# Altium project STM32四轴.PrjPCB
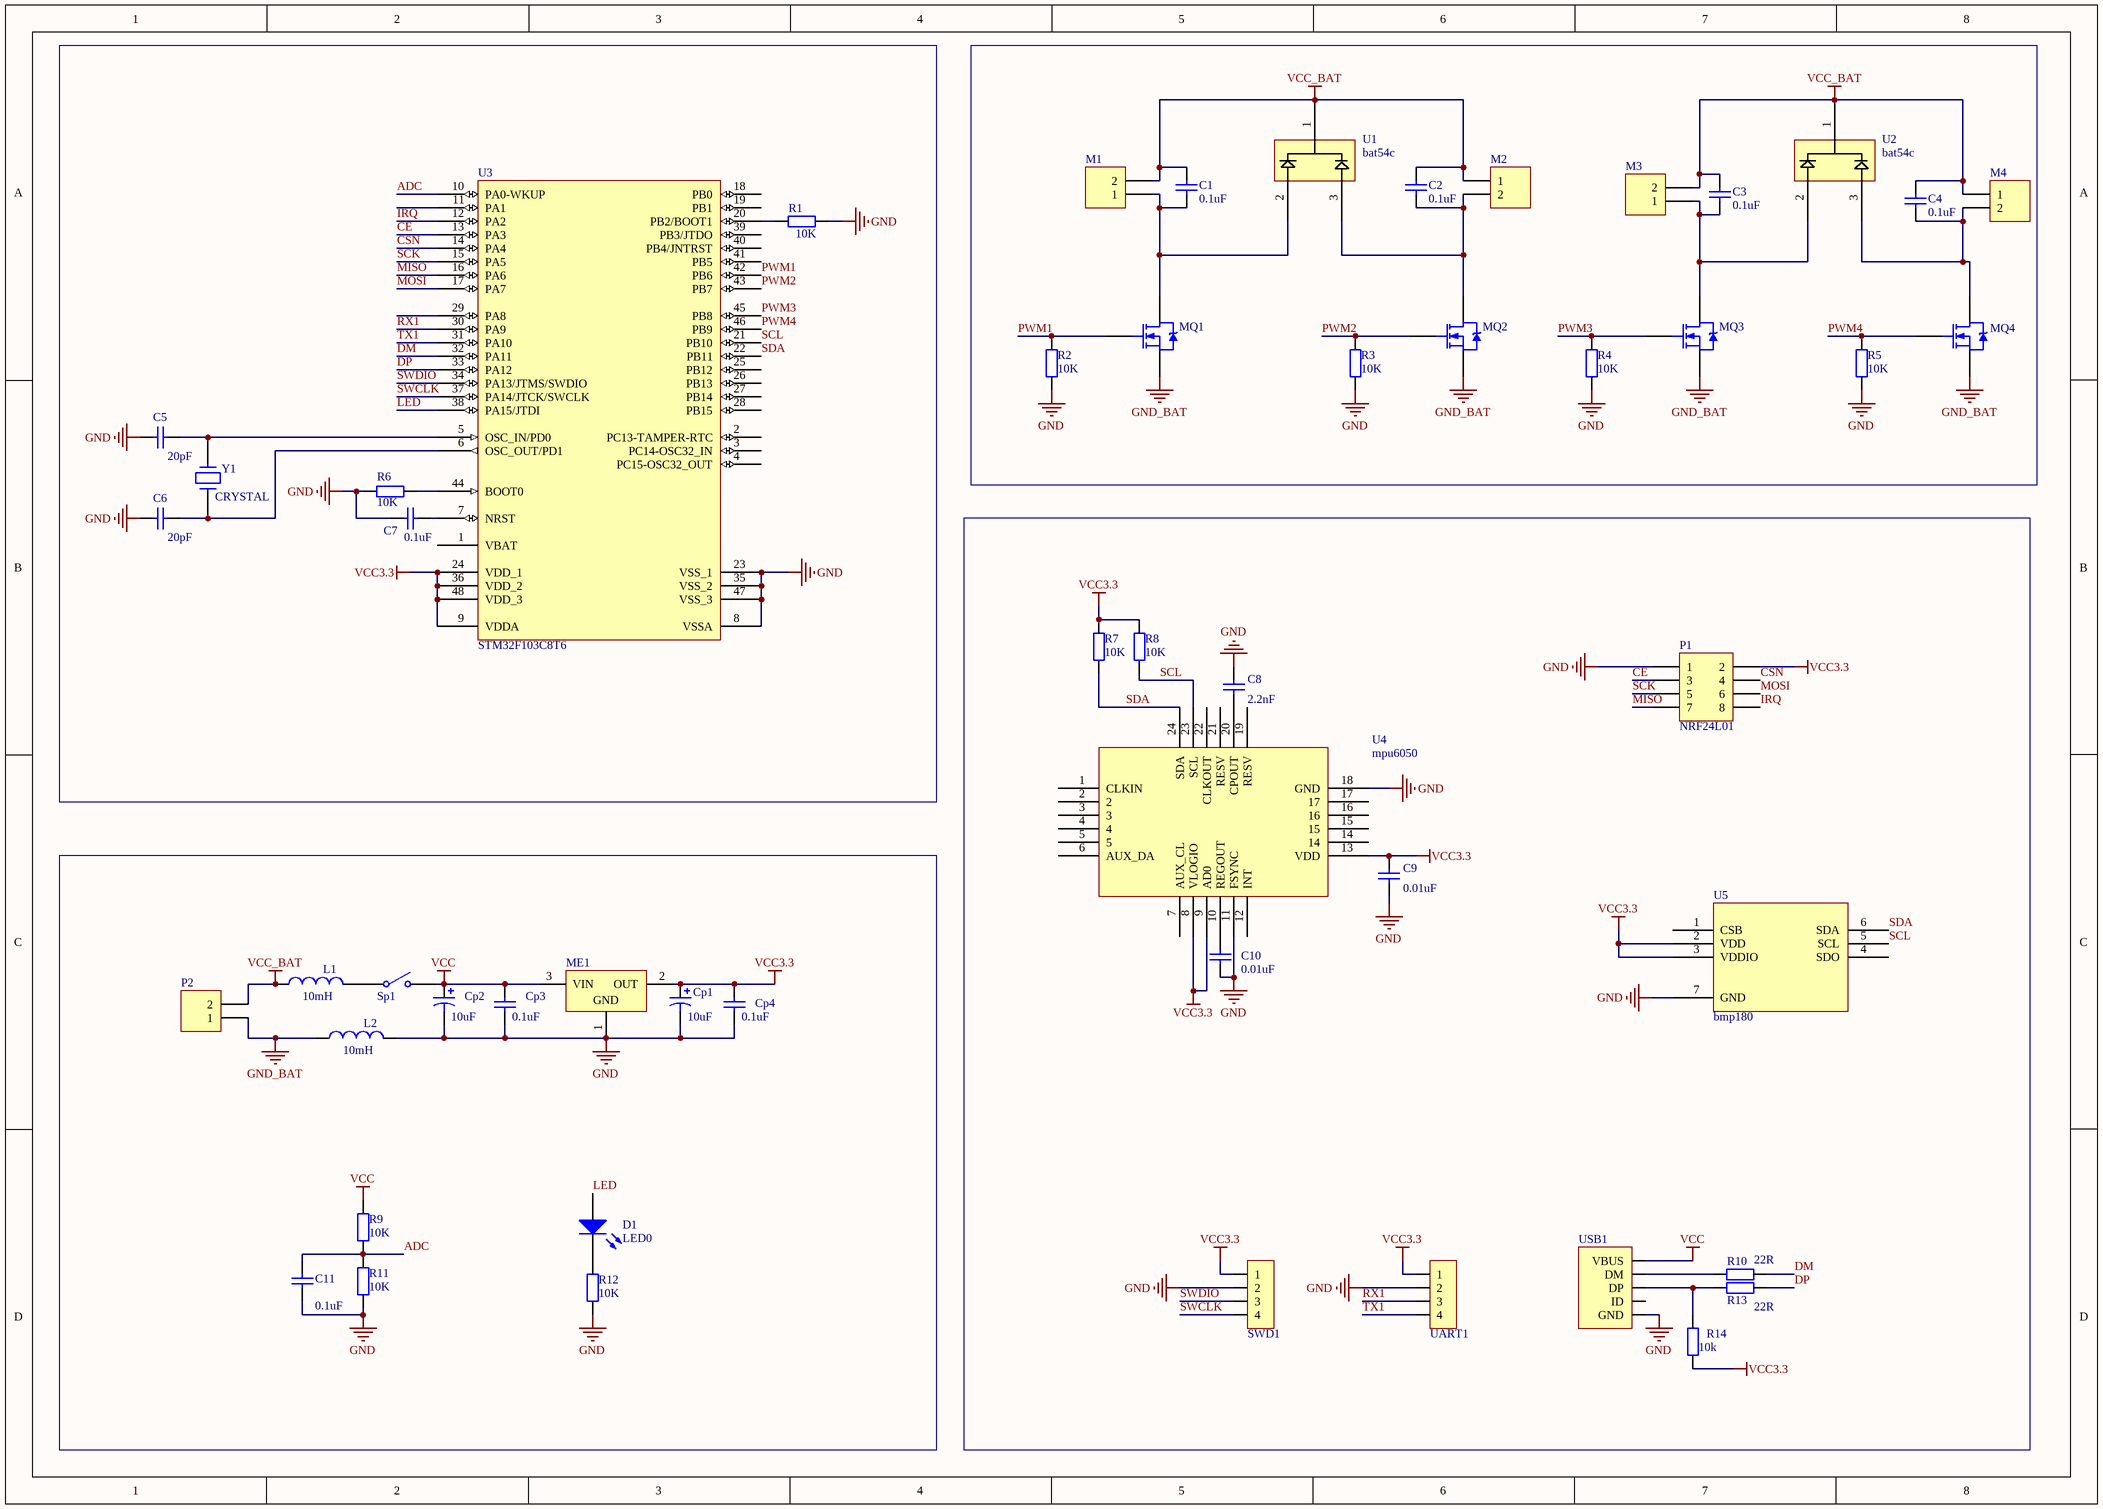
[diagram p0: STM32四轴.SchDoc]
3 sheets, 118 parts. Net scope: global (net labels, ports and power ports of the same name join across sheets).
Board file: STM32四轴.PcbDoc
Sheets:
  STM32四轴.SchDoc
  STM32遥控.SchDoc
  STC51.SchDoc

## Sheet STM32四轴.SchDoc
size A3

### Parts
C1  value 0.1uF  [0805s]  (hidden comment: Cap)
C2  value 0.1uF  [0805s]  (hidden comment: Cap)
C3  value 0.1uF  [0805s]  (hidden comment: Cap)
C4  value 0.1uF  [0805s]  (hidden comment: Cap)
C5  value 20pF  [0805s]  (hidden comment: Cap)
C6  value 20pF  [0805s]  (hidden comment: Cap)
C7  value 0.1uF  [0805s]  (hidden comment: Cap)
C8  value 2.2nF  [0805s]  (hidden comment: Cap)
C9  value 0.01uF  [0805s]  (hidden comment: Cap)
C10  value 0.01uF  [0805s]  (hidden comment: Cap)
C11  value 0.1uF  [0805s]  (hidden comment: Cap)
Cp1  value 10uF  [3216]  (hidden comment: Cap Pol1)
Cp2  value 10uF  [3216]  (hidden comment: Cap Pol1)
Cp3  value 0.1uF  [0805s]  (hidden comment: Cap)
Cp4  value 0.1uF  [0805s]  (hidden comment: Cap)
D1  LED0  [0805s]
L1  value 10mH  [0805s]  (hidden comment: Inductor)
L2  value 10mH  [0805s]  (hidden comment: Inductor)
M1  Header 2  [0805s]  (value not drawn)
M2  Header 2  [0805s]  (value not drawn)
M3  Header 2  [0805s]  (value not drawn)
M4  Header 2  [0805s]  (value not drawn)
ME1  Volt Reg  [SOT-23]  (value not drawn)
MQ1  NMOS-2  [SOT-23]  (value not drawn)
MQ2  NMOS-2  [SOT-23]  (value not drawn)
MQ3  NMOS-2  [SOT-23]  (value not drawn)
MQ4  NMOS-2  [SOT-23]  (value not drawn)
P1  NRF24L01  [HDR2X4]
P2  Header 2  [SIP2]  (value not drawn)
R1  value 10K  [0805s]  (hidden comment: Res2)
R2  value 10K  [0805s]  (hidden comment: Res2)
R3  value 10K  [0805s]  (hidden comment: Res2)
R4  value 10K  [0805s]  (hidden comment: Res2)
R5  value 10K  [0805s]  (hidden comment: Res2)
R6  value 10K  [0805s]  (hidden comment: Res2)
R7  value 10K  [0805s]  (hidden comment: Res2)
R8  value 10K  [0805s]  (hidden comment: Res2)
R9  value 10K  [0805s]  (hidden comment: Res2)
R10  value 22R  [0805s]  (hidden comment: Res_0603)
R11  value 10K  [0805s]  (hidden comment: Res2)
R12  value 10K  [0805s]  (hidden comment: Res2)
R13  value 22R  [0805s]  (hidden comment: Res_0603)
R14  value 10k  [0805s]  (hidden comment: Res_0603)
Sp1  SW-SPST  [SIP3]  (value not drawn)
SWD1  HDR1X4_180_2.54  [SIP4]  (value not drawn)
U1  bat54c  [SOT-23]
U2  bat54c  [SOT-23]
U3  STM32F103C8T6  [LQFP48]
U4  mpu6050  [MPU6050]
U5  bmp180  [LCC8]
UART1  HDR1X4_180_2.54  [SIP4]  (value not drawn)
USB1  USB_Micro  [MICRO-USB]  (value not drawn)
Y1  CRYSTAL  [SIP2]

### Nets
GND: C5.1 C6.1 C7.1 C8.2 C9.1 C10.1 C11.1 Cp1.2 Cp2.2 Cp3.1 Cp4.1 L2.2 ME1.1(GND) P1.1 R1.2 R2.2 R3.2 R4.2 R5.2 R6.2 R11.1 R12.1 SWD1.2 U3.8(VSSA) U3.23(VSS_1) U3.35(VSS_2) U3.47(VSS_3) U4.11(FSYNC) U4.18(GND) U5.7(GND) UART1.2 USB1.5(GND)
GND_BAT: L2.1 MQ1.2(S) MQ2.2(S) MQ3.2(S) MQ4.2(S) P2.1
VCC: Cp2.1 Cp3.2 ME1.3(VIN) R9.2 Sp1.2(NO) USB1.1(VBUS)
VCC3.3: C9.2 Cp1.1 Cp4.2 ME1.2(OUT) P1.2 R7.2 R8.2 R14.2 SWD1.1 U3.9(VDDA) U3.24(VDD_1) U3.36(VDD_2) U3.48(VDD_3) U4.8(VLOGIO) U4.9(AD0) U4.13(VDD) U5.2(VDD) U5.3(VDDIO) UART1.1
VCC_BAT: C1.1 C2.1 C3.1 C4.1 L1.1 M1.2 M2.1 M3.2 M4.1 P2.2 U1.1 U2.1
ADC: C11.2 R9.1 R11.2 U3.10(PA0-WKUP)
CE: P1.3 U3.13(PA3)
CSN: P1.4 U3.14(PA4)
DM: R10.2 U3.32(PA11)
DP: R13.2 U3.33(PA12)
IRQ: P1.8 U3.12(PA2)
LED: D1.1(A) U3.38(PA15/JTDI)
MISO: P1.7 U3.16(PA6)
MOSI: P1.6 U3.17(PA7)
PWM1: MQ1.1(G) R2.1 U3.42(PB6)
PWM2: MQ2.1(G) R3.1 U3.43(PB7)
PWM3: MQ3.1(G) R4.1 U3.45(PB8)
PWM4: MQ4.1(G) R5.1 U3.46(PB9)
RX1: U3.30(PA9) UART1.3
SCK: P1.5 U3.15(PA5)
SCL: R8.1 U3.21(PB10) U4.23(SCL) U5.5(SCL)
SDA: R7.1 U3.22(PB11) U4.24(SDA) U5.6(SDA)
SWCLK: SWD1.4 U3.37(PA14/JTCK/SWCLK)
SWDIO: SWD1.3 U3.34(PA13/JTMS/SWDIO)
TX1: U3.31(PA10) UART1.4
NetC1_2: C1.2 M1.1 MQ1.3(D) U1.2
NetC2_2: C2.2 M2.2 MQ2.3(D) U1.3
NetC3_2: C3.2 M3.1 MQ3.3(D) U2.2
NetC4_2: C4.2 M4.2 MQ4.3(D) U2.3
NetC5_2: C5.2 U3.5(OSC_IN/PD0) Y1.2
NetC6_2: C6.2 U3.6(OSC_OUT/PD1) Y1.1
NetC7_2: C7.2 U3.7(NRST)
NetC8_1: C8.1 U4.20(CPOUT)
NetC10_2: C10.2 U4.10(REGOUT)
NetD1_2: D1.2(K) R12.2
NetL1_2: L1.2 Sp1.1(COMMON)
NetR1_1: R1.1 U3.20(PB2/BOOT1)
NetR6_1: R6.1 U3.44(BOOT0)
NetR10_1: R10.1 USB1.2(DM)
NetR13_1: R13.1 R14.1 USB1.3(DP)

Not connected (* = marked no-connect by the designer): U3 1(VBAT) 2(PC13-TAMPER-RTC) 3(PC14-OSC32_IN) 4(PC15-OSC32_OUT) 11(PA1) 18(PB0) 19(PB1) 25(PB12) 26(PB13) 27(PB14) 28(PB15) 29(PA8) 39(PB3/JTDO) 40(PB4/JNTRST) 41(PB5); U4 1(CLKIN) 2 3 4 5 6(AUX_DA) 7(AUX_CL) 12(INT) 14 15 16 17 19(RESV) 21(RESV) 22(CLKOUT); U5 1(CSB) 4(SDO); USB1 4(ID)

### Library data of the parts
C1-C11 Cp3 Cp4 = Cap: Capacitor; Published: 8-Jun-2000; LatestRevisionDate: 17-Jul-2002; LatestRevisionNote: Re-released for DXP Platform.; PackageReference: RAD-0.3; Publisher: Altium Limited
Cp1 Cp2 = Cap Pol1: Polarized Capacitor (Radial); Published: 8-Jun-2000; LatestRevisionDate: 17-Jul-2002; LatestRevisionNote: Re-released for DXP Platform.; PackageReference: RB7.6-15; Publisher: Altium Limited
D1 = LED0: Typical INFRARED GaAs LED; Published: 8-Jun-2000; LatestRevisionDate: 08-Jul-2005; LatestRevisionNote: Mech Layer 1 removed.; PackageReference: LED-0; Publisher: Altium Limited
L1 L2 = Inductor: Code_IEC: 1005; Published: 8-Jun-2000; LatestRevisionDate: 29-May-2009; LatestRevisionNote: IPC-7351 Footprint Added.; PackageReference: 0402-A; Publisher: Altium Limited; PackageDescription: Chip Inductor; Code_JEITA: 0402
M1-M4 P2 = Header 2: Header, 2-Pin; LatestRevisionDate: 17-Jul-2002; LatestRevisionNote: Re-released for DXP Platform.; Publisher: Altium Limited
ME1 = Volt Reg: Voltage Regulator; Published: 24-Mar-1999; LatestRevisionDate: 29-May-2009; LatestRevisionNote: IPC-7351 Footprint Added.; PackageReference: D2PAK; Publisher: Altium Limited; PackageDescription: 3-Pin Transistor Outline Package 2.54 mm Pitch, 15.1 mm Lead Span
MQ1-MQ4 = NMOS-2: N-Channel Power MOSFET; Note: Pin 2 is electrically connected to pin 4.; Published: 8-Jun-2000; LatestRevisionDate: 17-Jul-2002; LatestRevisionNote: Re-released for DXP Platform.; DatasheetVersion: PD-9.814; PackageReference: TO-220AB; Publisher: Altium Limited; Code_JEDEC: TO-220-AB; ComponentLink1Description: Manufacturer Link; ComponentLink1URL: http://www.irf.com/
P1 = MHDR2X4: Header, 4-Pin, Dual row; LatestRevisionDate: 17-Jul-2002; LatestRevisionNote: Re-released for DXP Platform.; Publisher: Altium Limited
R1-R9 R11 R12 = Res2: Resistor; Published: 8-Jun-2000; LatestRevisionDate: 17-Jul-2002; LatestRevisionNote: Re-released for DXP Platform.; PackageReference: AXIAL-0.4; Publisher: Altium Limited
R10 R13 R14 = Res_0603: Resistor
Sp1 = SW-SPST: Single-Pole, Single-Throw Switch; Published: 24-Mar-1999; LatestRevisionDate: 17-Jul-2002; LatestRevisionNote: Re-released for DXP Platform.; PackageReference: SPST-2; Publisher: Altium Limited
SWD1 UART1 = HDR1X4_180_2.54: Header
U3 = STM32F103C8T6: STM32 ARM-based 32-bit MCU with 64 Kbytes Flash, 48-pin LQFP, Industrial Temperature; Published: 30-May-2008; DatasheetVersion: rev6, Mar-2008; PackageVersion: Mar-2008; PackageReference: LQFP48; Publisher: Altium Limited; PackageDescription: 48-Pin Low-Profile Quad Flat Pack, 7 x 7 mm Body, 0.5 mm Pitch (LQFP48); ComponentLink1Description: Manufacturer Link; ComponentLink1URL: www.st.com/stm32; ComponentLink2Description: Datasheet; ComponentLink2URL: http://www.st.com/stonline/products/literature/ds/13587.pdf
USB1 = USB_Micro: USB

## Sheet STM32遥控.SchDoc
size A3
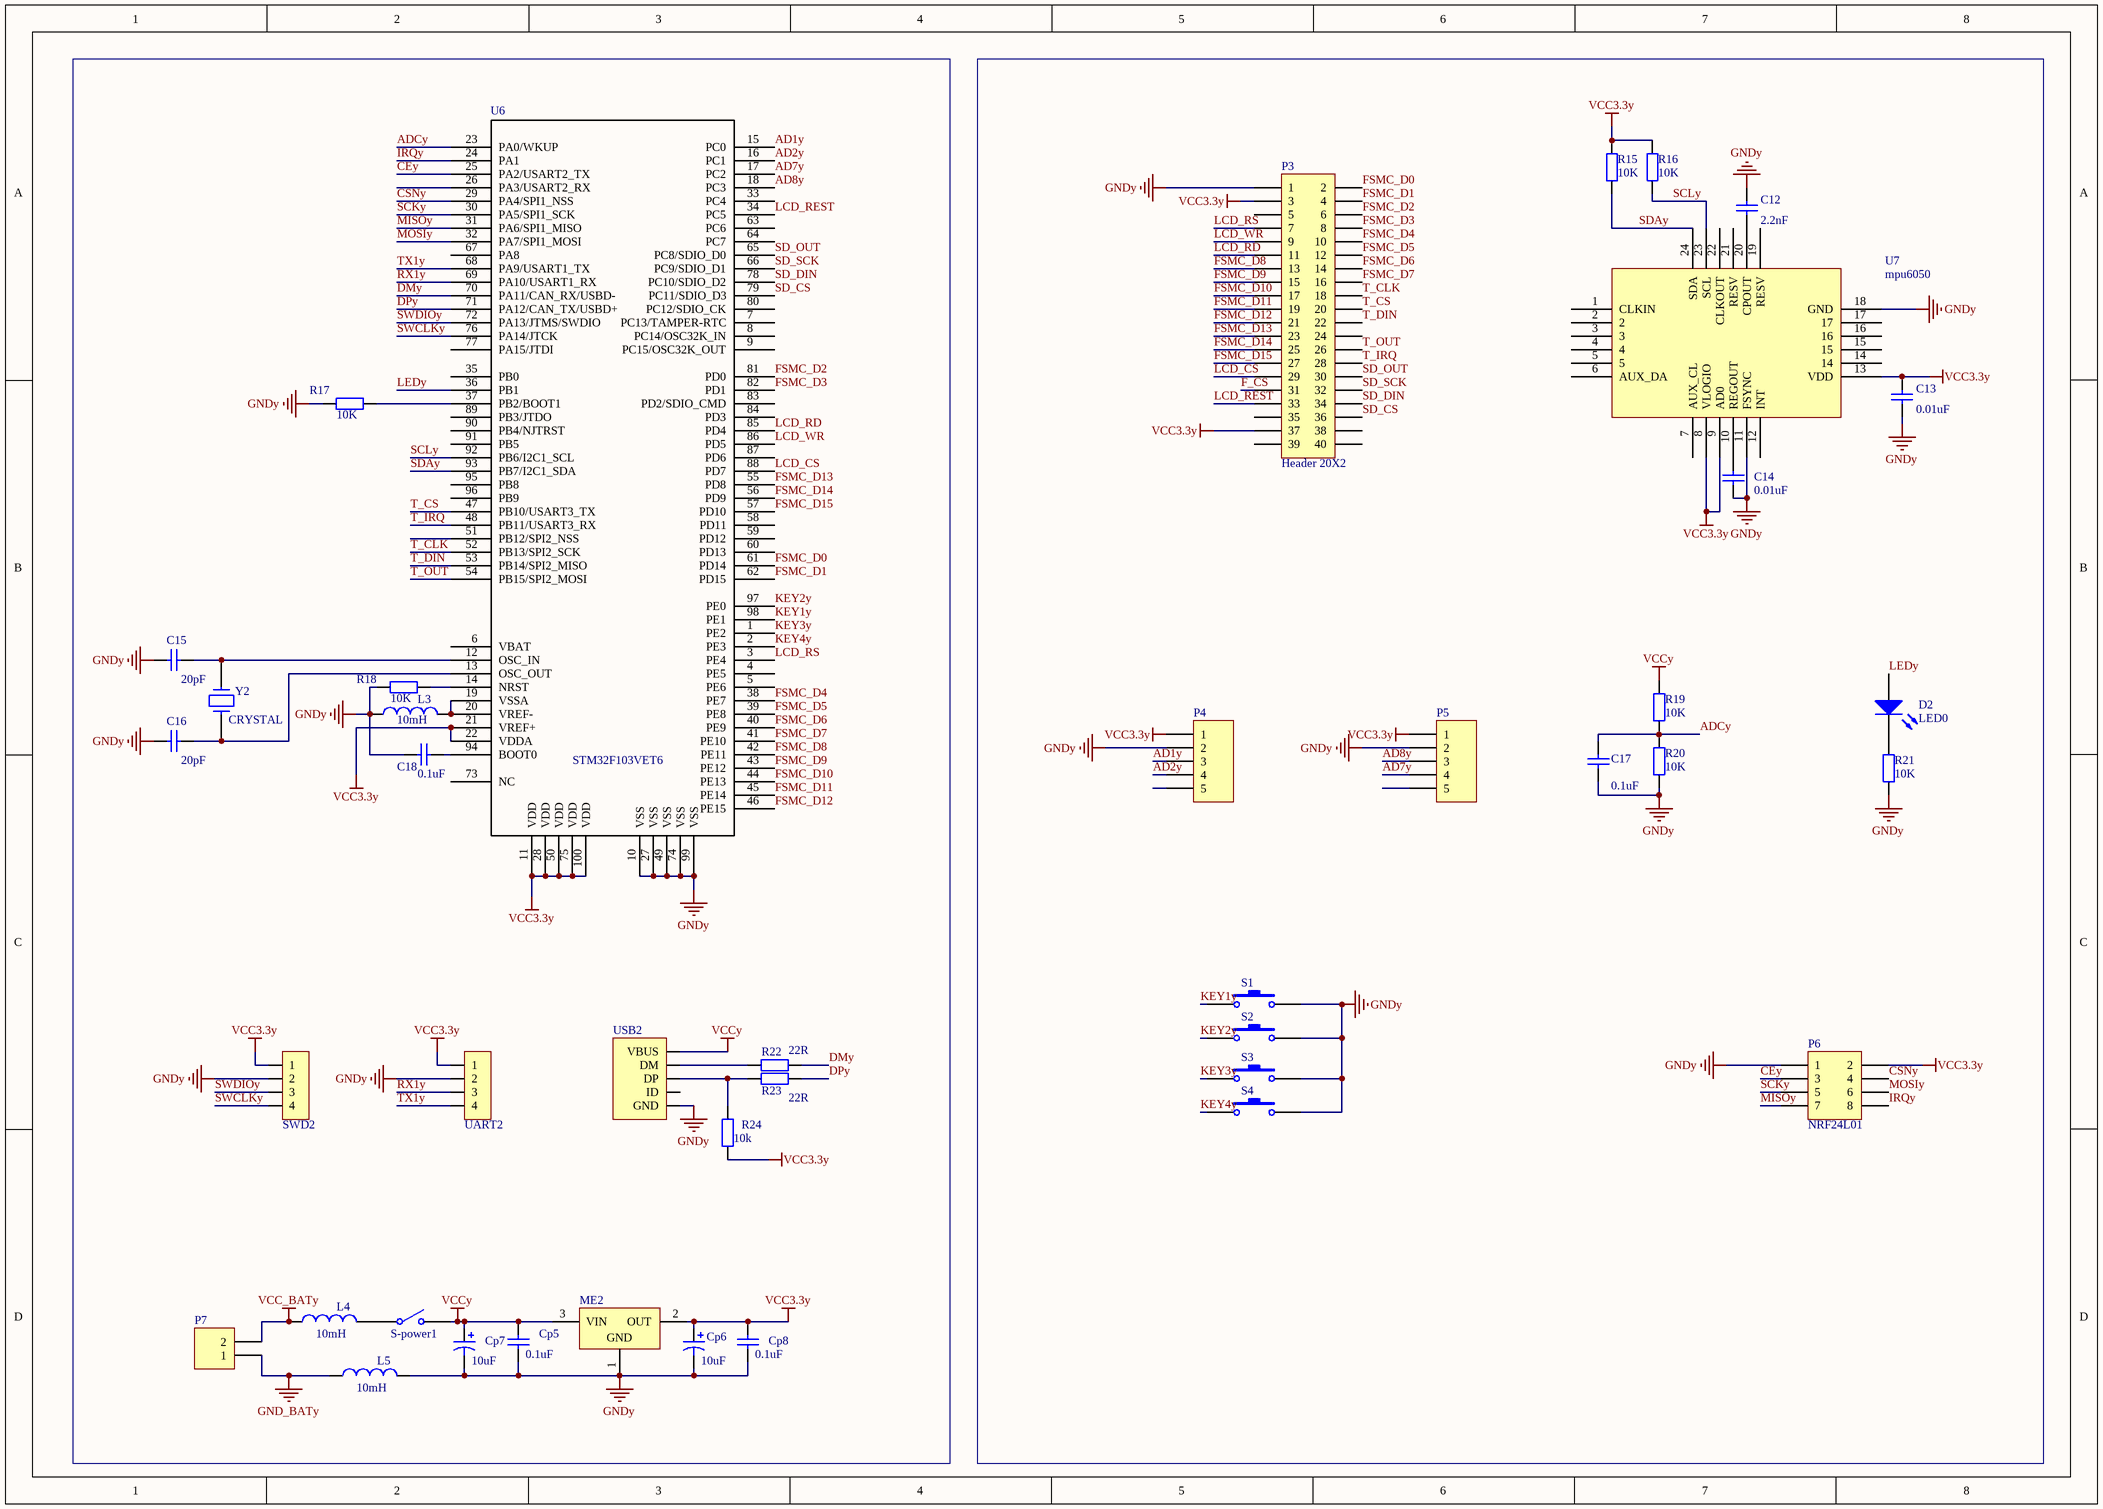
[diagram p1: STM32遥控.SchDoc]

### Parts
C12  value 2.2nF  [0805s]  (hidden comment: Cap)
C13  value 0.01uF  [0805s]  (hidden comment: Cap)
C14  value 0.01uF  [0805s]  (hidden comment: Cap)
C15  value 20pF  [0805s]  (hidden comment: Cap)
C16  value 20pF  [0805s]  (hidden comment: Cap)
C17  value 0.1uF  [0805s]  (hidden comment: Cap)
C18  value 0.1uF  [0805s]  (hidden comment: Cap)
Cp5  value 0.1uF  [0805s]  (hidden comment: Cap)
Cp6  value 10uF  [3216]  (hidden comment: Cap Pol1)
Cp7  value 10uF  [3216]  (hidden comment: Cap Pol1)
Cp8  value 0.1uF  [0805s]  (hidden comment: Cap)
D2  LED0  [0805s]
L3  value 10mH  [0805s]  (hidden comment: Inductor)
L4  value 10mH  [0805s]  (hidden comment: Inductor)
L5  value 10mH  [0805s]  (hidden comment: Inductor)
ME2  Volt Reg  [SOT-23]  (value not drawn)
P3  Header 20X2  [HDR2X20]
P4  Header 5  [yaogan]  (value not drawn)
P5  Header 5  [yaogan]  (value not drawn)
P6  NRF24L01  [HDR2X4]
P7  Header 2  [SIP2]  (value not drawn)
R15  value 10K  [0805s]  (hidden comment: Res2)
R16  value 10K  [0805s]  (hidden comment: Res2)
R17  value 10K  [0805s]  (hidden comment: Res2)
R18  value 10K  [0805s]  (hidden comment: Res2)
R19  value 10K  [0805s]  (hidden comment: Res2)
R20  value 10K  [0805s]  (hidden comment: Res2)
R21  value 10K  [0805s]  (hidden comment: Res2)
R22  value 22R  [0805s]  (hidden comment: Res_0603)
R23  value 22R  [0805s]  (hidden comment: Res_0603)
R24  value 10k  [0805s]  (hidden comment: Res_0603)
S1  SW-PB  [按键]  (value not drawn)
S2  SW-PB  [按键]  (value not drawn)
S3  SW-PB  [按键]  (value not drawn)
S4  SW-PB  [按键]  (value not drawn)
S-power1  SW-SPST  [SIP3]  (value not drawn)
SWD2  HDR1X4_180_2.54  [SIP4]  (value not drawn)
U6  STM32F103VET6  [LQFP100_N]
U7  mpu6050  [MPU6050]
UART2  HDR1X4_180_2.54  [SIP4]  (value not drawn)
USB2  USB_Micro  [MICRO-USB]  (value not drawn)
Y2  CRYSTAL  [SIP2]

### Nets
GND_BATy: L5.1 P7.1
GNDy: C12.2 C13.1 C14.1 C15.1 C16.1 C17.1 C18.1 Cp5.1 Cp6.2 Cp7.2 Cp8.1 L3.1 L5.2 ME2.1(GND) P3.1 P4.2 P5.2 P6.1 R17.2 R18.2 R20.1 R21.1 S1.2 S2.2 S3.2 S4.2 SWD2.2 U6.10(VSS) U6.27(VSS) U6.49(VSS) U6.74(VSS) U6.99(VSS) U7.11(FSYNC) U7.18(GND) UART2.2 USB2.5(GND)
VCC3.3y: C13.2 Cp6.1 Cp8.2 ME2.2(OUT) P3.3 P3.37 P4.1 P5.1 P6.2 R15.2 R16.2 R24.2 SWD2.1 U6.11(VDD) U6.21(VREF+) U6.22(VDDA) U6.28(VDD) U6.50(VDD) U6.75(VDD) U6.100(VDD) U7.8(VLOGIO) U7.9(AD0) U7.13(VDD) UART2.1
VCC_BATy: L4.1 P7.2
VCCy: Cp5.2 Cp7.1 ME2.3(VIN) R19.2 S-power1.2(NO) USB2.1(VBUS)
AD1y: P4.3 U6.15(PC0)
AD2y: P4.4 U6.16(PC1)
AD7y: P5.4 U6.17(PC2)
AD8y: P5.3 U6.18(PC3)
ADCy: C17.2 R19.1 R20.2 U6.23(PA0/WKUP)
CEy: P6.3 U6.25(PA2/USART2_TX)
CSNy: P6.4 U6.29(PA4/SPI1_NSS)
DMy: R22.2 U6.70(PA11/CAN_RX/USBD-)
DPy: R23.2 U6.71(PA12/CAN_TX/USBD+)
F_CS: P3.31
FSMC_D0: P3.2 U6.61(PD14)
FSMC_D1: P3.4 U6.62(PD15)
FSMC_D2: P3.6 U6.81(PD0)
FSMC_D3: P3.8 U6.82(PD1)
FSMC_D4: P3.10 U6.38(PE7)
FSMC_D5: P3.12 U6.39(PE8)
FSMC_D6: P3.14 U6.40(PE9)
FSMC_D7: P3.16 U6.41(PE10)
FSMC_D8: P3.13 U6.42(PE11)
FSMC_D9: P3.15 U6.43(PE12)
FSMC_D10: P3.17 U6.44(PE13)
FSMC_D11: P3.19 U6.45(PE14)
FSMC_D12: P3.21 U6.46(PE15)
FSMC_D13: P3.23 U6.55(PD8)
FSMC_D14: P3.25 U6.56(PD9)
FSMC_D15: P3.27 U6.57(PD10)
IRQy: P6.8 U6.24(PA1)
KEY1y: S1.1 U6.98(PE1)
KEY2y: S2.1 U6.97(PE0)
KEY3y: S3.1 U6.1(PE2)
KEY4y: S4.1 U6.2(PE3)
LCD_CS: P3.29 U6.88(PD7)
LCD_RD: P3.11 U6.85(PD4)
LCD_REST: P3.33 U6.34(PC5)
LCD_RS: P3.7 U6.3(PE4)
LCD_WR: P3.9 U6.86(PD5)
LEDy: D2.1(A) U6.36(PB1)
MISOy: P6.7 U6.31(PA6/SPI1_MISO)
MOSIy: P6.6 U6.32(PA7/SPI1_MOSI)
RX1y: U6.69(PA10/USART1_RX) UART2.3
SCKy: P6.5 U6.30(PA5/SPI1_SCK)
SCLy: R16.1 U6.92(PB6/I2C1_SCL) U7.23(SCL)
SD_CS: P3.36 U6.79(PC11/SDIO_D3)
SD_DIN: P3.34 U6.78(PC10/SDIO_D2)
SD_OUT: P3.30 U6.65(PC8/SDIO_D0)
SD_SCK: P3.32 U6.66(PC9/SDIO_D1)
SDAy: R15.1 U6.93(PB7/I2C1_SDA) U7.24(SDA)
SWCLKy: SWD2.4 U6.76(PA14/JTCK)
SWDIOy: SWD2.3 U6.72(PA13/JTMS/SWDIO)
T_CLK: P3.18 U6.52(PB13/SPI2_SCK)
T_CS: P3.20 U6.47(PB10/USART3_TX)
T_DIN: P3.22 U6.53(PB14/SPI2_MISO)
T_IRQ: P3.28 U6.48(PB11/USART3_RX)
T_OUT: P3.26 U6.54(PB15/SPI2_MOSI)
TX1y: U6.68(PA9/USART1_TX) UART2.4
NetC12_1: C12.1 U7.20(CPOUT)
NetC14_2: C14.2 U7.10(REGOUT)
NetC15_2: C15.2 U6.12(OSC_IN) Y2.2
NetC16_2: C16.2 U6.13(OSC_OUT) Y2.1
NetC18_2: C18.2 U6.94(BOOT0)
NetD2_2: D2.2(K) R21.2
NetL3_2: L3.2 U6.19(VSSA) U6.20(VREF-)
NetL4_2: L4.2 S-power1.1(COMMON)
NetR17_1: R17.1 U6.37(PB2/BOOT1)
NetR18_1: R18.1 U6.14(NRST)
NetR22_1: R22.1 USB2.2(DM)
NetR23_1: R23.1 R24.1 USB2.3(DP)

Not connected (* = marked no-connect by the designer): P3 5 24 35 38 39 40; P4 5; P5 5; U6 4(PE5) 5(PE6) 6(VBAT) 7(PC13/TAMPER-RTC) 8(PC14/OSC32K_IN) 9(PC15/OSC32K_OUT) 26(PA3/USART2_RX) 33(PC4) 35(PB0) 51(PB12/SPI2_NSS) 58(PD11) 59(PD12) 60(PD13) 63(PC6) 64(PC7) 67(PA8) 73(NC) 77(PA15/JTDI) 80(PC12/SDIO_CK) 83(PD2/SDIO_CMD) 84(PD3) 87(PD6) 89(PB3/JTDO) 90(PB4/NJTRST) 91(PB5) 95(PB8) 96(PB9); U7 1(CLKIN) 2 3 4 5 6(AUX_DA) 7(AUX_CL) 12(INT) 14 15 16 17 19(RESV) 21(RESV) 22(CLKOUT); USB2 4(ID)

### Library data of the parts
C12-C18 Cp5 Cp8 = Cap: Capacitor; Published: 8-Jun-2000; LatestRevisionDate: 17-Jul-2002; LatestRevisionNote: Re-released for DXP Platform.; PackageReference: RAD-0.3; Publisher: Altium Limited
Cp6 Cp7 = Cap Pol1: Polarized Capacitor (Radial); Published: 8-Jun-2000; LatestRevisionDate: 17-Jul-2002; LatestRevisionNote: Re-released for DXP Platform.; PackageReference: RB7.6-15; Publisher: Altium Limited
D2 = LED0: Typical INFRARED GaAs LED; Published: 8-Jun-2000; LatestRevisionDate: 08-Jul-2005; LatestRevisionNote: Mech Layer 1 removed.; PackageReference: LED-0; Publisher: Altium Limited
L3-L5 = Inductor: Code_IEC: 1005; Published: 8-Jun-2000; LatestRevisionDate: 29-May-2009; LatestRevisionNote: IPC-7351 Footprint Added.; PackageReference: 0402-A; Publisher: Altium Limited; PackageDescription: Chip Inductor; Code_JEITA: 0402
ME2 = Volt Reg: Voltage Regulator; Published: 24-Mar-1999; LatestRevisionDate: 29-May-2009; LatestRevisionNote: IPC-7351 Footprint Added.; PackageReference: D2PAK; Publisher: Altium Limited; PackageDescription: 3-Pin Transistor Outline Package 2.54 mm Pitch, 15.1 mm Lead Span
P3 = Header 20X2: Header, 20-Pin, Dual row; LatestRevisionDate: 17-Jul-2002; LatestRevisionNote: Re-released for DXP Platform.; Publisher: Altium Limited
P4 P5 = Header 5: Header, 5-Pin; LatestRevisionDate: 17-Jul-2002; LatestRevisionNote: Re-released for DXP Platform.; Publisher: Altium Limited
P6 = MHDR2X4: Header, 4-Pin, Dual row; LatestRevisionDate: 17-Jul-2002; LatestRevisionNote: Re-released for DXP Platform.; Publisher: Altium Limited
P7 = Header 2: Header, 2-Pin; LatestRevisionDate: 17-Jul-2002; LatestRevisionNote: Re-released for DXP Platform.; Publisher: Altium Limited
R15-R21 = Res2: Resistor; Published: 8-Jun-2000; LatestRevisionDate: 17-Jul-2002; LatestRevisionNote: Re-released for DXP Platform.; PackageReference: AXIAL-0.4; Publisher: Altium Limited
R22-R24 = Res_0603: Resistor
S1-S4 = SW-PB: Switch; Published: 24-Mar-1999; LatestRevisionDate: 17-Jul-2002; LatestRevisionNote: Re-released for DXP Platform.; PackageReference: SPST-2; Publisher: Altium Limited
S-power1 = SW-SPST: Single-Pole, Single-Throw Switch; Published: 24-Mar-1999; LatestRevisionDate: 17-Jul-2002; LatestRevisionNote: Re-released for DXP Platform.; PackageReference: SPST-2; Publisher: Altium Limited
SWD2 UART2 = HDR1X4_180_2.54: Header
USB2 = USB_Micro: USB

## Sheet STC51.SchDoc
size A4
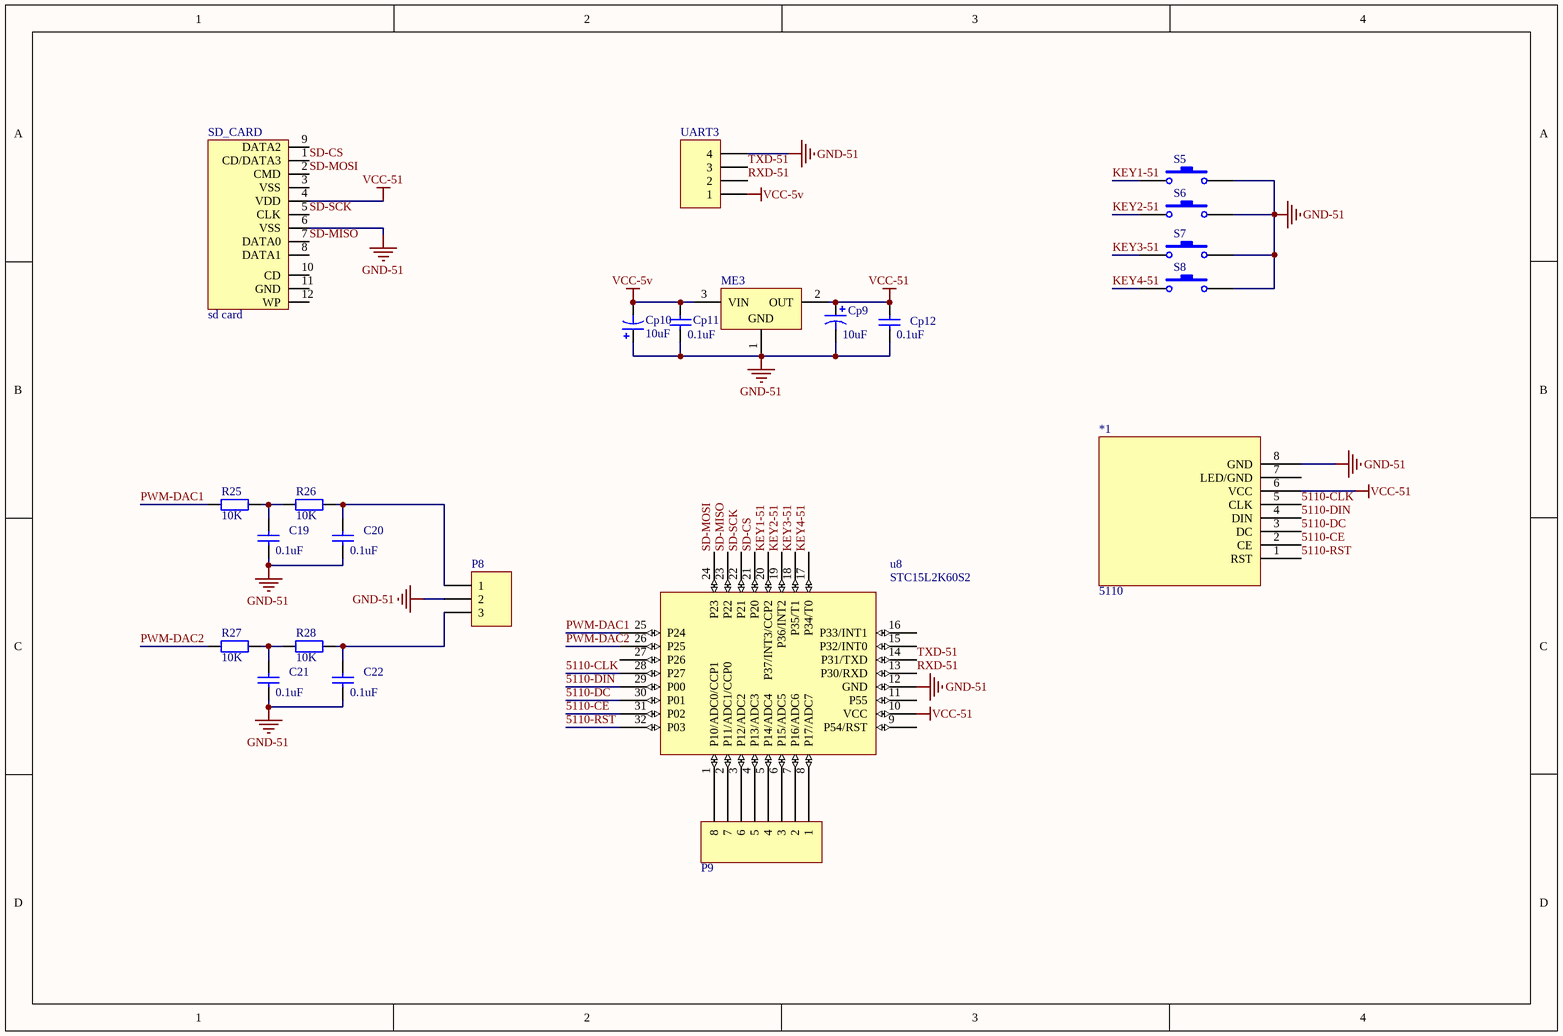
[diagram p2: STC51.SchDoc]

### Parts
*1  5110  [5110]
C19  value 0.1uF  [0805s]  (hidden comment: Cap)
C20  value 0.1uF  [0805s]  (hidden comment: Cap)
C21  value 0.1uF  [0805s]  (hidden comment: Cap)
C22  value 0.1uF  [0805s]  (hidden comment: Cap)
Cp9  value 10uF  [3216]  (hidden comment: Cap Pol1)
Cp10  value 10uF  [3216]  (hidden comment: Cap Pol1)
Cp11  value 0.1uF  [0805]  (hidden comment: Cap)
Cp12  value 0.1uF  [0805]  (hidden comment: Cap)
ME3  Volt Reg  [SOT-23]  (value not drawn)
P8  Header 3  [HDR1X3]  (value not drawn)
P9  Header 8  [HDR1X8]  (value not drawn)
R25  value 10K  [0805s]  (hidden comment: Res2)
R26  value 10K  [0805s]  (hidden comment: Res2)
R27  value 10K  [0805s]  (hidden comment: Res2)
R28  value 10K  [0805s]  (hidden comment: Res2)
S5  SW-PB  [按键]  (value not drawn)
S6  SW-PB  [按键]  (value not drawn)
S7  SW-PB  [按键]  (value not drawn)
S8  SW-PB  [按键]  (value not drawn)
SD_CARD  sd card  [SD卡]
u8  STC15L2K60S2  [LQFP-32]
UART3  Header 4  [HDR1X4]  (value not drawn)

### Nets
GND-51: *1.8(GND) C19.1 C20.1 C21.1 C22.1 Cp9.2 Cp10.1 Cp11.1 Cp12.1 ME3.1(GND) P8.2 S5.2 S6.2 S7.2 S8.2 SD_CARD.6(VSS) u8.12(GND) UART3.4
VCC-5v: Cp10.2 Cp11.2 ME3.3(VIN) UART3.1
VCC-51: *1.6(VCC) Cp9.1 Cp12.2 ME3.2(OUT) SD_CARD.4(VDD) u8.10(VCC)
5110-CE: *1.2(CE) u8.31(P02)
5110-CLK: *1.5(CLK) u8.28(P27)
5110-DC: *1.3(DC) u8.30(P01)
5110-DIN: *1.4(DIN) u8.29(P00)
5110-RST: *1.1(RST) u8.32(P03)
KEY1-51: S5.1 u8.20(P37/INT3/CCP2)
KEY2-51: S6.1 u8.19(P36/INT2)
KEY3-51: S7.1 u8.18(P35/T1)
KEY4-51: S8.1 u8.17(P34/T0)
PWM-DAC1: R25.2 u8.25(P24)
PWM-DAC2: R27.2 u8.26(P25)
RXD-51: u8.13(P30/RXD) UART3.2
SD-CS: SD_CARD.1(CD/DATA3) u8.21(P20)
SD-MISO: SD_CARD.7(DATA0) u8.23(P22)
SD-MOSI: SD_CARD.2(CMD) u8.24(P23)
SD-SCK: SD_CARD.5(CLK) u8.22(P21)
TXD-51: u8.14(P31/TXD) UART3.3
NetC19_2: C19.2 R25.1 R26.2
NetC20_2: C20.2 P8.1 R26.1
NetC21_2: C21.2 R27.1 R28.2
NetC22_2: C22.2 P8.3 R28.1
NetP9_1: P9.1 u8.8(P17/ADC7)
NetP9_2: P9.2 u8.7(P16/ADC6)
NetP9_3: P9.3 u8.6(P15/ADC5)
NetP9_4: P9.4 u8.5(P14/ADC4)
NetP9_5: P9.5 u8.4(P13/ADC3)
NetP9_6: P9.6 u8.3(P12/ADC2)
NetP9_7: P9.7 u8.2(P11/ADC1/CCP0)
NetP9_8: P9.8 u8.1(P10/ADC0/CCP1)

Not connected (* = marked no-connect by the designer): *1 7(LED/GND); SD_CARD 3(VSS) 8(DATA1) 9(DATA2) 10(CD) 11(GND) 12(WP); u8 9(P54/RST) 11(P55) 15(P32/INT0) 16(P33/INT1) 27(P26)

### Library data of the parts
C19-C22 Cp11 Cp12 = Cap: Capacitor; Published: 8-Jun-2000; LatestRevisionDate: 17-Jul-2002; LatestRevisionNote: Re-released for DXP Platform.; PackageReference: RAD-0.3; Publisher: Altium Limited
Cp9 Cp10 = Cap Pol1: Polarized Capacitor (Radial); Published: 8-Jun-2000; LatestRevisionDate: 17-Jul-2002; LatestRevisionNote: Re-released for DXP Platform.; PackageReference: RB7.6-15; Publisher: Altium Limited
ME3 = Volt Reg: Voltage Regulator; Published: 24-Mar-1999; LatestRevisionDate: 29-May-2009; LatestRevisionNote: IPC-7351 Footprint Added.; PackageReference: D2PAK; Publisher: Altium Limited; PackageDescription: 3-Pin Transistor Outline Package 2.54 mm Pitch, 15.1 mm Lead Span
P8 = Header 3: Header, 3-Pin; LatestRevisionDate: 17-Jul-2002; LatestRevisionNote: Re-released for DXP Platform.; Publisher: Altium Limited
P9 = Header 8: Header, 8-Pin; LatestRevisionDate: 17-Jul-2002; LatestRevisionNote: Re-released for DXP Platform.; Publisher: Altium Limited
R25-R28 = Res2: Resistor; Published: 8-Jun-2000; LatestRevisionDate: 17-Jul-2002; LatestRevisionNote: Re-released for DXP Platform.; PackageReference: AXIAL-0.4; Publisher: Altium Limited
S5-S8 = SW-PB: Switch; Published: 24-Mar-1999; LatestRevisionDate: 17-Jul-2002; LatestRevisionNote: Re-released for DXP Platform.; PackageReference: SPST-2; Publisher: Altium Limited
UART3 = Header 4: Header, 4-Pin; LatestRevisionDate: 17-Jul-2002; LatestRevisionNote: Re-released for DXP Platform.; Publisher: Altium Limited